# EAGLE design CS-I-SW-DPDT (EAGLE 6.4)
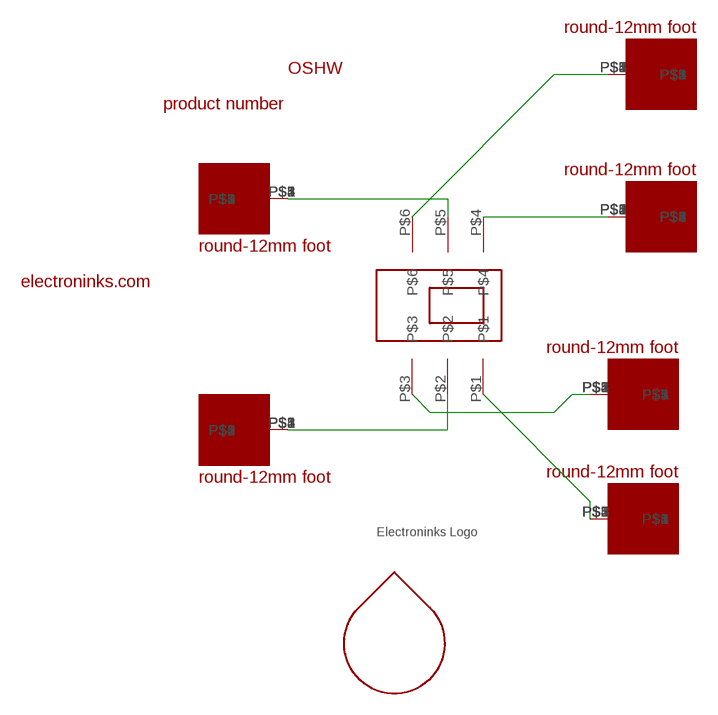
[diagram p0: schematic, sheet 1]

## Parts
U$1  ROUND-12MM-FOOT-1.8MM  [ROUND-12MM-FOOT]
U$2  ROUND-12MM-FOOT-1.8MM  [ROUND-12MM-FOOT]
U$3  ROUND-12MM-FOOT-1.8MM  [ROUND-12MM-FOOT]
U$4  ROUND-12MM-FOOT-1.8MM  [ROUND-12MM-FOOT]
U$5  ROUND-12MM-FOOT-1.8MM  [ROUND-12MM-FOOT]
U$6  ROUND-12MM-FOOT-1.8MM  [ROUND-12MM-FOOT]
U$7  CL-SB-22A-02T-SLIDE-SWITCH-TUCKED-PADS  [CL-SB-22A-02T-DPDT-COMPACT-SWITCH]
U$8  ELECTRONINKS_LOGO_15MM  [ELECTRONINKS_LOGO_15MM]
U$9  ELECTRONINKS_COM_15MM  [ELECTRONINKS_COM_15MM]
U$10  OSHW_4MM  [OHSW_4MM]
U$11  DROPLET_LOGO_4MM  [DROPLET_LOGO_4MM]
U$12  CS_I_SW_DPDT  [CS_I_SW_DPDT]

## Nets
N$1: U$1.P$1 U$7.P$5
N$2: U$4.P$1 U$7.P$2
N$3: U$2.P$1 U$7.P$6
N$4: U$5.P$1 U$7.P$3
N$5: U$3.P$1 U$7.P$4
N$6: U$6.P$1 U$7.P$1
Unconnected: U$1.P$2 U$1.P$3 U$1.P$4 U$1.P$5 U$2.P$2 U$2.P$3 U$2.P$4 U$2.P$5 U$3.P$2 U$3.P$3 U$3.P$4 U$3.P$5 U$4.P$2 U$4.P$3 U$4.P$4 U$4.P$5 U$5.P$2 U$5.P$3 U$5.P$4 U$5.P$5 U$6.P$2 U$6.P$3 U$6.P$4 U$6.P$5

## Library data of the parts
U$1-U$6 = electroninks:ROUND-12MM-FOOT-1.8MM
U$7 = electroninks:CL-SB-22A-02T-SLIDE-SWITCH-TUCKED-PADS
U$8 = electroninks:ELECTRONINKS_LOGO_15MM
U$9 = electroninks:ELECTRONINKS_COM_15MM
U$10 = electroninks:OSHW_4MM
U$11 = electroninks:DROPLET_LOGO_4MM
U$12 = electroninks:CS_I_SW_DPDT

## Board
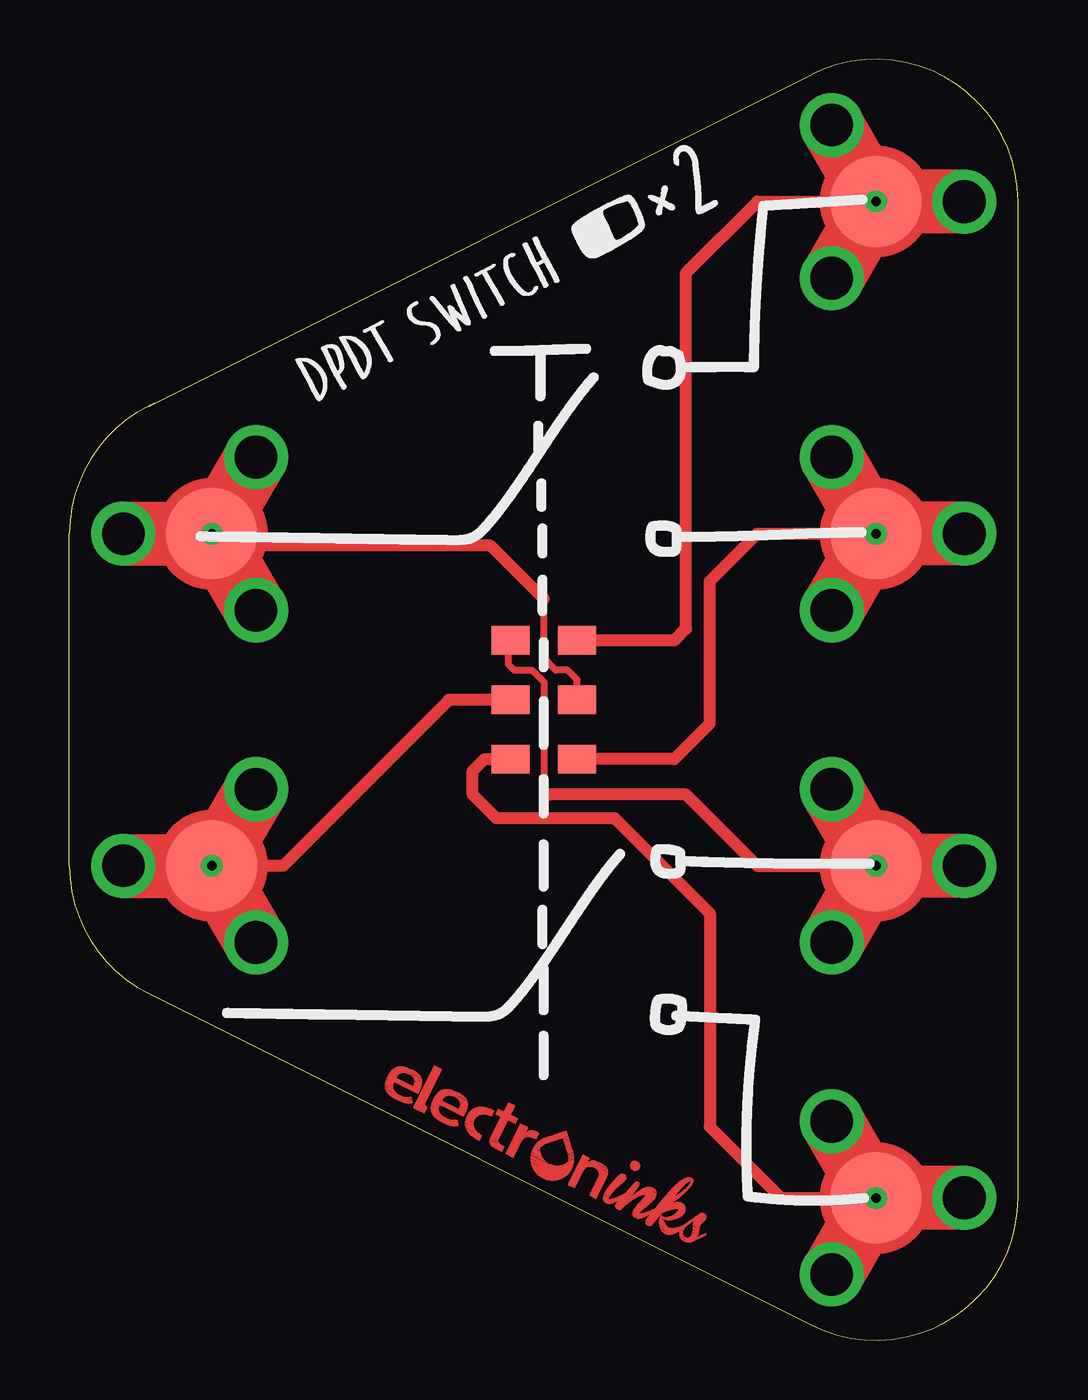
[diagram p1: board, top side]
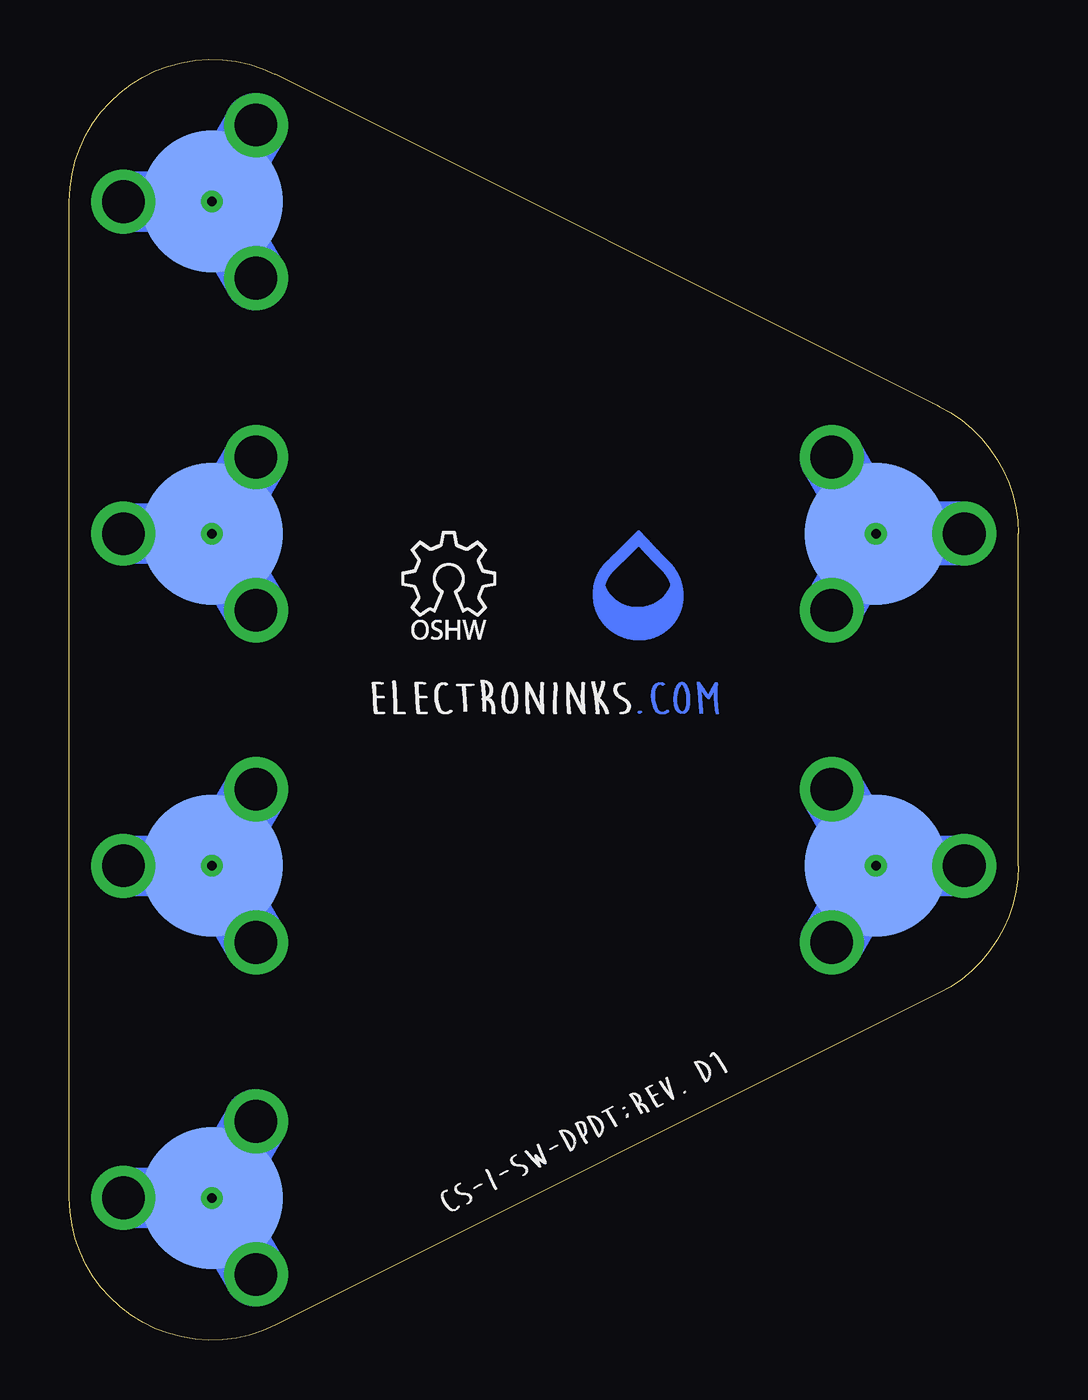
[diagram p2: board, bottom side, seen from below]

Size 40 x 54 mm. Coordinates in mm from the lower left corner, seen from the top.
Outline: 3.6,39.5 arc3 3.32,39.37
Outline: 3.32,39.37 31.32,53.37 arc-117 40,48 40,6 arc-117 31.32,0.63 3.32,14.63 arc-63 0,20 0,34 arc-63 3.32,39.37
Copper layers (1*16): Top 0.035mm / dielectric 1.5mm / Bottom 0.035mm
Design rules "default": minimum track width 10mil, minimum drill 24mil, track to track 8mil, track to pad 8mil, pad to pad 8mil, via to via 8mil, smd to smd 8mil, copper to edge 40mil, drill to drill 8mil, minimum pad ring 10mil, minimum via ring 8mil, stop-mask expansion 4mil, vias tented up to drill 0mil, thermal gap 10mil

### Footprints (pad centres in the part's own frame; a part is rotated, then mirrored left to right if it is on the bottom)
ROUND-12MM-FOOT = drill 1.8: P$1 -3.726,0; P$2 1.863,3.227; P$3 1.863,-3.227 | smd 3.85 x 3.85: P$4 0,0 | smd 6 x 6 bottom: P$5 0,0 | drill 0.4: P$6 0,0
CL-SB-22A-02T-DPDT-COMPACT-SWITCH = smd 1.2 x 1.6: P$1 -2.5,-1.4; P$2 0,-1.4; P$3 2.5,-1.4; P$4 -2.5,1.4; P$5 0,1.4; P$6 2.5,1.4

### Placement (x,y rotation side)
U$1  6,20 0 top
U$2  34,20 180 top
U$3  34,6 180 top
U$4  6,34 120 top
U$5  34,48 180 top
U$6  34,34 180 top
U$7  20,27 90 top
U$8  13.01,10.28 333.6 top
U$9  27.5,26 0 bottom
U$10  26,29.25 0 bottom
U$11  16,31 0 bottom
U$12  24,5 27 bottom

### Tracks (layer width: path | path; a pad name or v marks a point on that pad's centre or on a via)
N$1
  Top 0.5: U$7.P$5 16,27 9,20 6,20
N$2
  Top 0.3: U$7.P$2 21.4,27.85 21,28.25 20.5,28.25 20,28.75 20,31.25
  Top 0.5: 20,31.25 17.75,33.5 5.5,33.5 6,34
N$3
  Top 0.3: 20.25,23 20,23.25 20,27.75 19.5,28.25 18.75,28.25 18.5,28.5 18.5,29.4 U$7.P$6
  Top 0.5: 34,20 29,20 26,23 20.25,23
N$4
  Top 0.5: U$7.P$3 25.5,29.5 26,30 26,45 29,48 34,48
N$5
  Top 0.5: U$7.P$4 17.5,24.5 17,24 17,23 18,22 23,22 27,18 27,9 30,6 34,6
N$6
  Top 0.5: 34,34 29,34 27,32 27,26 25.5,24.5 U$7.P$1